# Altium schematic sheet ESP32.SchDoc
size 381 x 241 mm; SheetNumber: 1; SheetTotal: 5
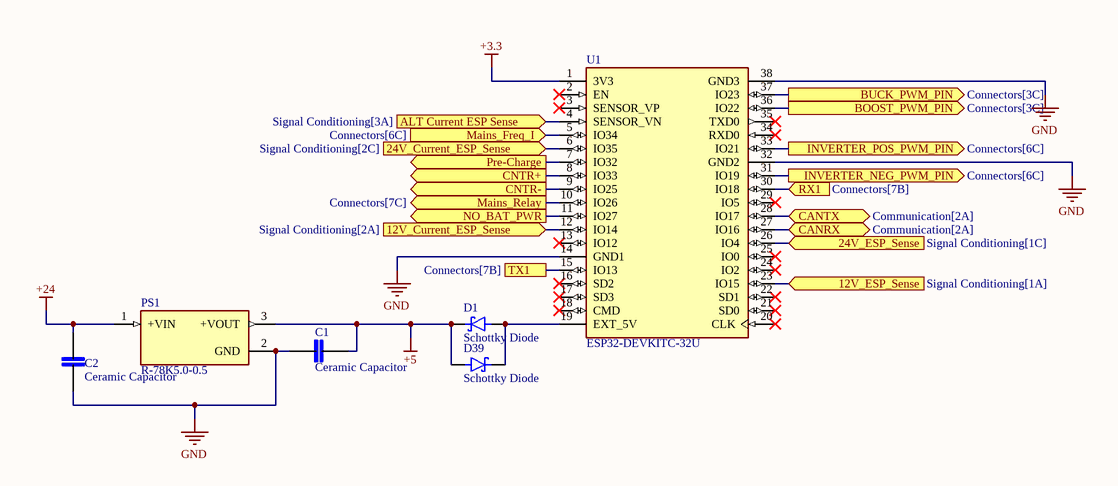
[diagram p0: ESP32.SchDoc]

## Parts
C1  Ceramic Capacitor  [Ceramic Capacitor]
C2  Ceramic Capacitor  [Ceramic Capacitor]
D1  Schottky Diode  [Common Trhough Hole]
D39  Schottky Diode  [Common Trhough Hole]
PS1  R-78K5.0-0.5  [CONV_R-78K5.0-0.5]
U1  ESP32-DEVKITC-32U  [MODULE_ESP32-DEVKITC-32U]

## Ports
12V_Current_ESP_Sense (in, see Signal Conditioning[2A]), 12V_ESP_Sense (in, see Signal Conditioning[1A]), 24V_Current_ESP_Sense (in, see Signal Conditioning[2C]), 24V_ESP_Sense (in, see Signal Conditioning[1C]), ALT Current ESP Sense (in, see Signal Conditioning[3A]), BOOST_PWM_PIN (out, see Connectors[3C]), BUCK_PWM_PIN (out, see Connectors[3C]), CANRX (bidir, see Communication[2A]), CANTX (bidir, see Communication[2A]), CNTR+ (out), CNTR- (out), INVERTER_NEG_PWM_PIN (out, see Connectors[6C]), INVERTER_POS_PWM_PIN (out, see Connectors[6C]), Mains_Freq_I (in, see Connectors[6C]), Mains_Relay (out, see Connectors[7C]), NO_BAT_PWR (out), Pre-Charge (out), RX1 (in, see Connectors[7B]), TX1 (see Connectors[7B])

## Nets
+3.3: U1.1(3V3)
+5: C1.2 D1.1(K) D39.2(A) PS1.3(+VOUT)
+24: C2.2 PS1.1(+VIN)
GND: C1.1 C2.1 PS1.2(GND) U1.14(GND1) U1.32(GND2) U1.38(GND3)
12V_Current_ESP_Sense: U1.12(IO14) ; port 12V_Current_ESP_Sense
12V_ESP_Sense: U1.23(IO15) ; port 12V_ESP_Sense
24V_Current_ESP_Sense: U1.6(IO35) ; port 24V_Current_ESP_Sense
24V_ESP_Sense: U1.26(IO4) ; port 24V_ESP_Sense
ALT Current ESP Sense: U1.4(SENSOR_VN) ; port ALT Current ESP Sense
BOOST_PWM_PIN: U1.36(IO22) ; port BOOST_PWM_PIN
BUCK_PWM_PIN: U1.37(IO23) ; port BUCK_PWM_PIN
CANRX: U1.27(IO16) ; port CANRX
CANTX: U1.28(IO17) ; port CANTX
CNTR+: U1.8(IO33) ; port CNTR+
CNTR-: U1.9(IO25) ; port CNTR-
INVERTER_NEG_PWM_PIN: U1.31(IO19) ; port INVERTER_NEG_PWM_PIN
INVERTER_POS_PWM_PIN: U1.33(IO21) ; port INVERTER_POS_PWM_PIN
Mains_Freq_I: U1.5(IO34) ; port Mains_Freq_I
Mains_Relay: U1.10(IO26) ; port Mains_Relay
NO_BAT_PWR: U1.11(IO27) ; port NO_BAT_PWR
Pre-Charge: U1.7(IO32) ; port Pre-Charge
RX1: U1.30(IO18) ; port RX1
TX1: U1.15(IO13) ; port TX1
NetD1_2: D1.2(A) D39.1(K) U1.19(EXT_5V)

Not connected (* = marked no-connect by the designer): U1 2(EN)* 3(SENSOR_VP)* 13(IO12)* 16(SD2)* 17(SD3)* 18(CMD)* 20(CLK)* 21(SD0)* 22(SD1)* 24(IO2)* 25(IO0)* 29(IO5)* 34(RXD0)* 35(TXD0)*

## Library data of the parts
C1 C2 = Ceramic Capacitor: MP: LD051A121KAB2A; MF: AVX; SnapEDA_Link: https://www.snapeda.com/parts/LD051A121KAB2A/AVX/view-part/?ref=snap; Package: 0805 AVX; Check_prices: https://www.snapeda.com/parts/LD051A121KAB2A/AVX/view-part/?ref=eda; Purchase-URL: https://pricing.snapeda.com/search/part/LD051A121KAB2A/?ref=eda; Price: None; Value: *; Availability: In Stock
D1 D39 = Schottky Diode: MF: Diodes Inc.; MP: 1N5817-T; Package: DO-41 Diodes Inc.; Price: None; Check_prices: https://www.snapeda.com/parts/1N5817-T/Diodes+Inc./view-part/?ref=eda; Value: *; SnapEDA_Link: https://www.snapeda.com/parts/1N5817-T/Diodes+Inc./view-part/?ref=snap; Availability: In Stock; Purchase-URL: https://pricing.snapeda.com/search/part/1N5817-T/?ref=eda
PS1 = R-78K5.0-0.5: 0.5A DC/DC-Converter 'INNOLINE' SIP3 reg; MF: Recom Power; Package: None; Value: *; Check_prices: https://www.snapeda.com/parts/R-78K5.0-0.5/Recom+Power/view-part/?ref=eda; Purchase-URL: https://pricing.snapeda.com/search/part/R-78K5.0-0.5/?ref=eda; Availability: In Stock; SnapEDA_Link: https://www.snapeda.com/parts/R-78K5.0-0.5/Recom+Power/view-part/?ref=snap; Price: None; MP: R-78K5.0-0.5
U1 = ESP32-DEVKITC-32U: ESP32-WROOM-32UE series Transceiver; 802.11 b/g/n (Wi-Fi, WiFi, WLAN), BluetoothÂ® Smart Ready 4.x Dual Mode Evaluation Board; MF: Espressif Systems; SnapEDA_Link: https://www.snapeda.com/parts/ESP32-DEVKITC-32U/Espressif+Systems/view-part/?ref=snap; Availability: In Stock; Purchase-URL: https://pricing.snapeda.com/search/part/ESP32-DEVKITC-32U/?ref=eda; Check_prices: https://www.snapeda.com/parts/ESP32-DEVKITC-32U/Espressif+Systems/view-part/?ref=eda; Value: *; Package: None; MP: ESP32-DEVKITC-32U; Price: None